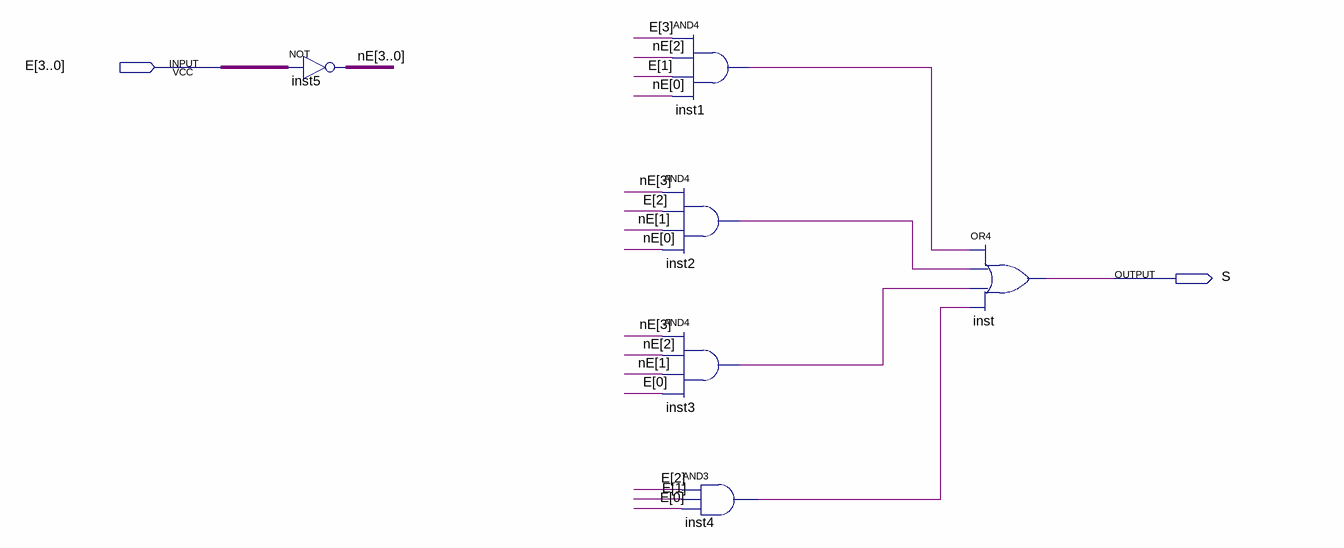
[diagram p0: schematic sheet]
// Quartus schematic ledD.bdf as structural Verilog: 6 symbols, 2 pins
module ledD (
  input  [3:0] E,
  output S
);

  wire inst1_out, inst2_out, inst3_out, inst4_out;
  wire [3:0] nE;

  assign nE = ~E;  // NOT inst5, 4 bits wide
  and inst1 (inst1_out, E[3], nE[2], E[1], nE[0]);
  and inst2 (inst2_out, nE[3], E[2], nE[1], nE[0]);
  and inst3 (inst3_out, nE[3], nE[2], nE[1], E[0]);
  and inst4 (inst4_out, E[2], E[1], E[0]);
  or inst (S, inst1_out, inst2_out, inst3_out, inst4_out);
endmodule
